# EAGLE design MCU Board V1.2.1 (EAGLE 6.5.0)
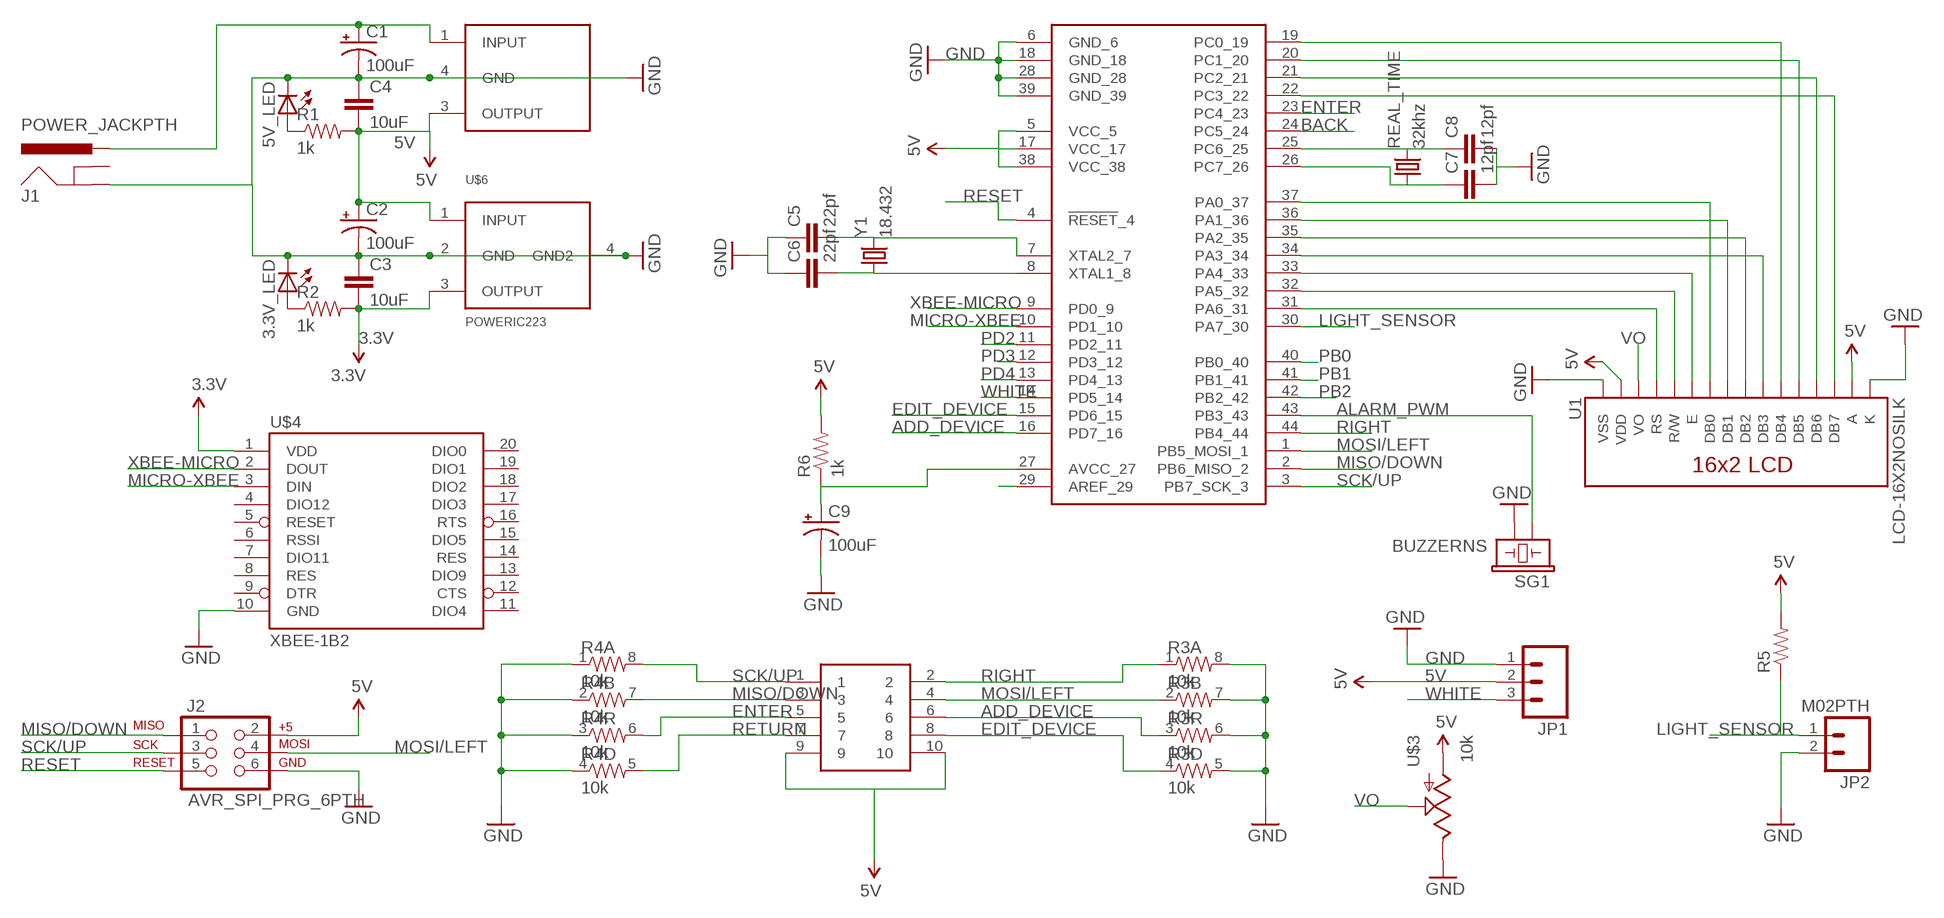
[diagram p0: schematic, sheet 1]

## Parts
3.3V_LED  LED1206  [LED-1206]
5V_LED  LED1206  [LED-1206]
C1  100uF  CAP_POLD  [PANASONIC_D]
C2  100uF  CAP_POLD  [PANASONIC_D]
C3  10uF  CAP1206  [1206]
C4  10uF  CAP1206  [1206]
C5  22pf  CAP0805  [0805]
C6  22pf  CAP0805  [0805]
C7  12pf  CAP0805  [0805]
C8  12pf  CAP0805  [0805]
C9  100uF  CAP_POLD  [PANASONIC_D]
J1  POWER_JACKPTH  [POWER_JACK_PTH]
J2  AVR_SPI_PRG_6PTH  [2X3]
JP1  M03PTH  [1X03]
JP2  M02PTH  [1X02]
R1  1k  RESISTOR1206  [1206]
R2  1k  RESISTOR1206  [1206]
R3  10k  RESISTOR-ARRAY0603-ARV  [0603-ARV]
R4  10k  RESISTOR-ARRAY0603-ARV  [0603-ARV]
R5  RESISTOR1206  [1206]
R6  1k  RESISTOR1206  [1206]
REAL_TIME  32khz  CRYSTALTC26H  [TC26H]
SG1  BUZZERNS  [BUZZER-12MM-NS]
U1  LCD-16X2NOSILK  [LCD-16X2_NOSILK]
U$1  ATMEGA1284  [TQFP44]
U$2  10PIN_HEADER_MALETHROUGH-HOLE  [2X5-SHROUDED]
U$3  10k  POTTRIM  [TRIM_POT]
U$4  XBEE-1B2  [XBEE-SILK]
U$5  DPACK_V_REG  [DPAK]
U$6  POWERIC223  [SOT223]
Y1  18.432  CRYSTALHC49US  [HC49US]

## Nets
3.3V: C3.2 R2.2 U$4.1(VDD) U$6.3(OUTPUT)
5V: C2.+ C4.2 J2.2 JP1.2 R1.2 R5.2 R6.2 U1.2(VDD) U1.15(A) U$1.5(VCC_5) U$1.17(VCC_17) U$1.38(VCC_38) U$2.9 U$2.10 U$3.3(A) U$5.3(OUTPUT) U$6.1(INPUT)
ADD_DEVICE: R3.3 U$1.16(PD7_16) U$2.6
ALARM_PWM: SG1.+ U$1.43(PB3_43)
AREF: U$1.29(AREF_29)
BACK: U$1.24(PC5_24)
EDIT_DEVICE: R3.4 U$1.15(PD6_15) U$2.8
ENTER: R4.6 U$1.23(PC4_23) U$2.5
GND: 3.3V_LED.C 5V_LED.C C1.- C2.- C3.1 C4.1 C5.1 C6.1 C7.2 C8.2 C9.- J1.GND J2.6 JP1.1 JP2.2 R3.5 R3.6 R3.7 R3.8 R4.1 R4.2 R4.3 R4.4 SG1.- U1.1(VSS) U1.16(K) U$1.6(GND_6) U$1.18(GND_18) U$1.28(GND_28) U$1.39(GND_39) U$3.2(E) U$4.10(GND) U$5.4(GND) U$6.2(GND) U$6.4(GND2)
LIGHT_SENSOR: JP2.1 R5.1 U$1.30(PA7_30)
MICRO-XBEE: U$1.10(PD1_10) U$4.3(DIN)
MISO/DOWN: J2.1 R4.7 U$1.2(PB6_MISO_2) U$2.3
MOSI/LEFT: J2.4 R3.2 U$1.1(PB5_MOSI_1) U$2.4
N$1: C7.1 REAL_TIME.1 U$1.26(PC7_26)
N$2: C5.2 U$1.7(XTAL2_7) Y1.2
N$3: C6.2 U$1.8(XTAL1_8) Y1.1
N$4: C8.1 REAL_TIME.2 U$1.25(PC6_25)
N$5: 5V_LED.A R1.1
N$6: 3.3V_LED.A R2.1
N$7: U1.7(DB0) U$1.37(PA0_37)
N$8: U1.8(DB1) U$1.36(PA1_36)
N$9: U1.9(DB2) U$1.35(PA2_35)
N$10: U1.10(DB3) U$1.34(PA3_34)
N$11: U1.6(E) U$1.33(PA4_33)
N$12: U1.5(R/W) U$1.32(PA5_32)
N$13: U1.4(RS) U$1.31(PA6_31)
N$14: U1.11(DB4) U$1.19(PC0_19)
N$15: U1.12(DB5) U$1.20(PC1_20)
N$16: U1.13(DB6) U$1.21(PC2_21)
N$17: U1.14(DB7) U$1.22(PC3_22)
N$19: C9.+ R6.1 U$1.27(AVCC_27)
PB0: U$1.40(PB0_40)
PB1: U$1.41(PB1_41)
PB2: U$1.42(PB2_42)
PD2: U$1.11(PD2_11)
PD3: U$1.12(PD3_12)
PD4: U$1.13(PD4_13)
PWR: C1.+ J1.PWR U$5.1(INPUT)
RESET: J2.5 U$1.4(!RESET!_4)
RETURN: R4.5 U$2.7
RIGHT: R3.1 U$1.44(PB4_44) U$2.2
SCK/UP: J2.3 R4.8 U$1.3(PB7_SCK_3) U$2.1
VO: U1.3(VO) U$3.1(S)
WHITE: JP1.3 U$1.14(PD5_14)
XBEE-MICRO: U$1.9(PD0_9) U$4.2(DOUT)
Unconnected: J1.GNDBREAK U$4.4(DIO12) U$4.5(RESET) U$4.6(RSSI) U$4.7(DIO11) U$4.8(RES) U$4.9(DTR) U$4.11(DIO4) U$4.12(CTS) U$4.13(DIO9) U$4.14(RES) U$4.15(DIO5) U$4.16(RTS) U$4.17(DIO3) U$4.18(DIO2) U$4.19(DIO1) U$4.20(DIO0)

## Library data of the parts
3.3V_LED 5V_LED = SparkFun-LED:LED: LEDs Standard schematic elements and footprints for 5mm, 3mm, 1206, and 0603 sized LEDs. 5mm - Spark Fun Electronics SKU : COM-00529 (and others)
C1 C2 C9 = SparkFun-Capacitors:CAP_POL: Capacitor Polarized These are standard SMD and PTH capacitors. Normally 10uF, 47uF, and 100uF in electrolytic and tantalum varieties. Always verify the external diameter of the through hole cap, it varies with capacity, voltage, and manufacturer. The EIA devices should be standard.
C3-C6 = SparkFun-Capacitors:CAP: Capacitor Standard 0603 ceramic capacitor, and 0.1" leaded capacitor.
C7 C8 = SparkFun-Passives:CAP: Capacitor Standard 0603 ceramic capacitor, and 0.1" leaded capacitor.
J1 = SparkFun-Connectors:POWER_JACK: Power Jack This is the standard 5.5mm barrel jack for power. The PTH is the most common, proven, reliable, footprint. The Slot footprint only works if the mill layer is transmitted to the PCB fab house so be warned. Spark Fun Electronics SKU : PRT-00119 SMT: CONN-08106 Mating wall wart : TOL-00298 (and others)
J2 = SparkFun-Connectors:AVR_SPI_PRG_6: AVR ISP 6 Pin This is the reduced ISP connector for AVR programming. Common on Arduino. This footprint will take up less PCB space and can be used with a 10-pin to 6-pin adapter such as SKU: BOB-08508
JP1 = SparkFun-Connectors:M03: Header 3 Standard 3-pin 0.1" header. Use with straight break away headers (SKU : PRT-00116), right angle break away headers (PRT-00553), swiss pins (PRT-00743), machine pins (PRT-00117), and female headers (PRT-00115). Molex polarized connector foot print use with SKU : PRT-08232 with associated crimp pins and housings.
JP2 = SparkFun-Connectors:M02: Standard 2-pin 0.1" header. Use with - straight break away headers ( PRT-00116) - right angle break away headers (PRT-00553) - swiss pins (PRT-00743) - machine pins (PRT-00117) - female headers (PRT-00115) Molex polarized connector foot print use with: PRT-08233 with associated crimp pins and housings. 2.54_SCREWTERM for use with PRT-10571. 3.5mm Screw Terminal footprints for PRT-08084 5mm Screw Terminal footprints for use with PRT-08433
R1 R2 R5 R6 = SparkFun-Resistors:RESISTOR: Resistor Basic schematic elements and footprints for 0603, 1206, and PTH resistors.
R3 R4 = SparkFun-Resistors:RESISTOR-ARRAY: Array Chip Resistor Source: RS Component / Phycomp
REAL_TIME Y1 = SparkFun-FreqCtrl:CRYSTAL: Various standard crystals. Proven footprints. Spark Fun Electronics SKU : COM-00534
SG1 = SparkFun-Electromechanical:BUZZER: Buzzer 12mm Spark Fun Electronics SKU : Comp-Buzzer
U1 = SparkFun-Displays:LCD-16X2: Standard text-only 16x2 parallel input LCD
U$1 = NU STEM:ATMEGA1284
U$2 = NU STEM:10PIN_HEADER_MALE
U$3 = SparkFun-Electromechanical:POT
U$4 = SparkFun-RF:XBEE-1: Xbee module footprints SMT header is CONN-09042.
U$5 = NU STEM:DPACK_V_REG
U$6 = NU STEM:POWERIC223

## Board
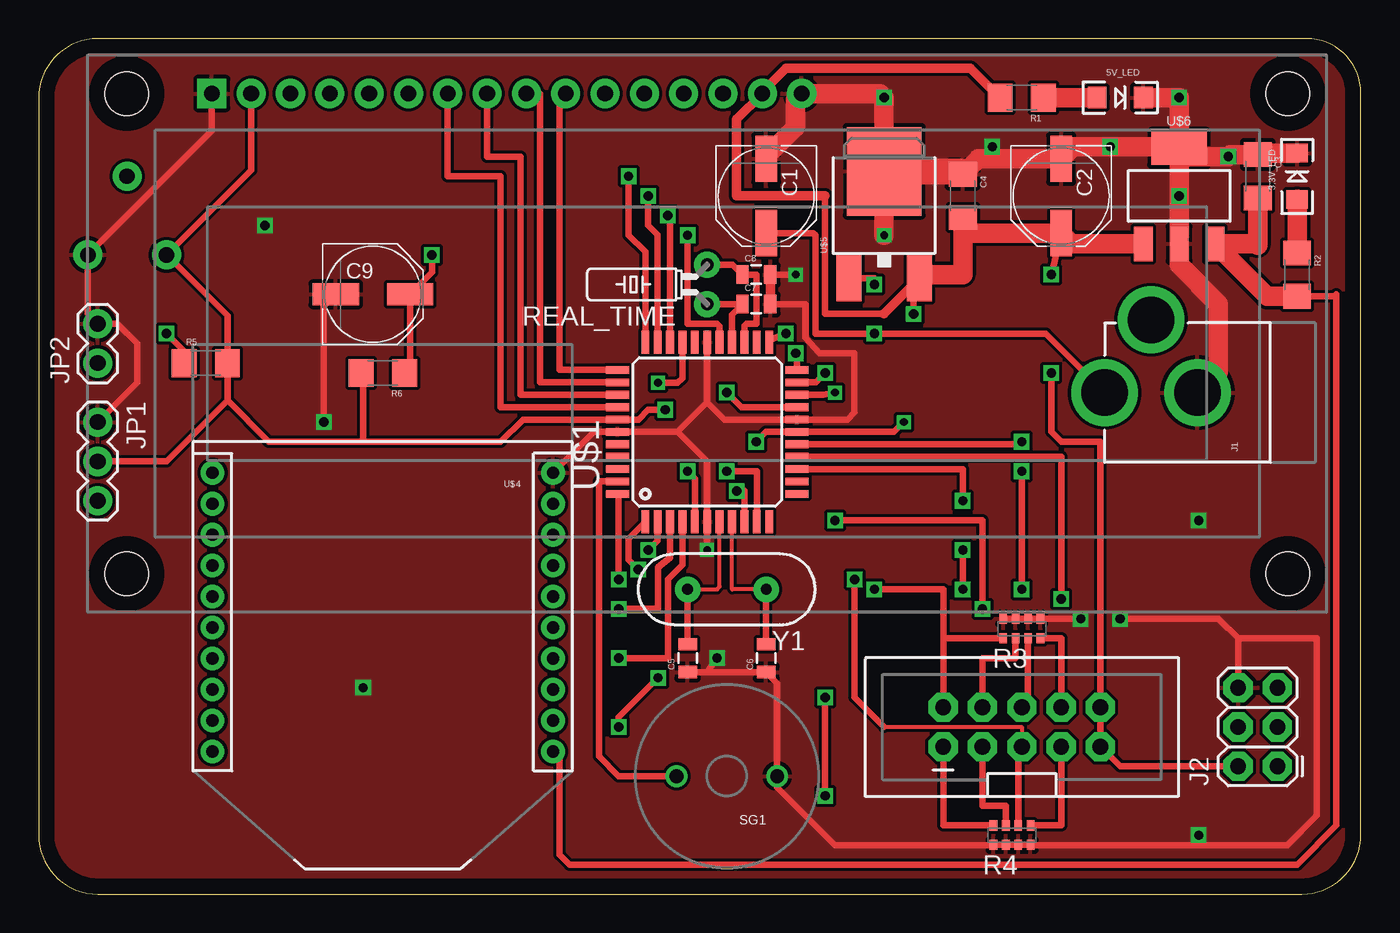
[diagram p1: board, top side]
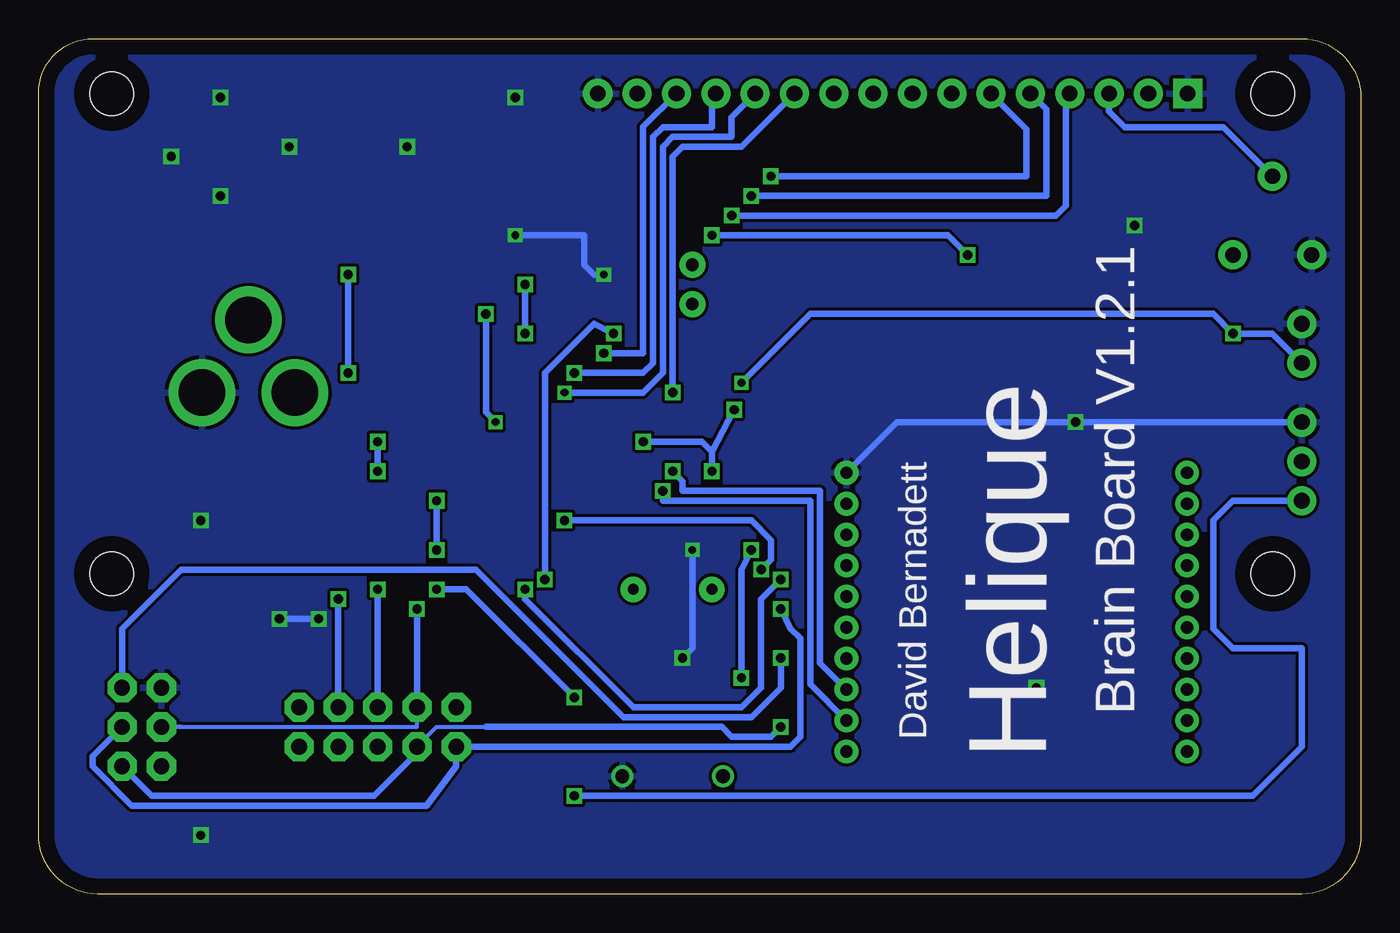
[diagram p2: board, bottom side, seen from below]

Size 85.39 x 55.23 mm. Coordinates in mm from the lower left corner, seen from the top.
Outline: 0,51.42 0,3.81 arc90 3.81,0 81.57,0 arc90 85.39,3.82 85.39,51.76 arc90 81.92,55.23 3.81,55.23 arc90 0,51.42
Copper layers (1*16): Top 0.035mm / dielectric 1.5mm / Bottom 0.035mm
Design rules "default *": minimum track width 10mil, minimum drill 13mil, track to track 8mil, track to pad 8mil, pad to pad 8mil, via to via 8mil, smd to smd 8mil, copper to edge 40mil, drill to drill 8mil, minimum pad ring 10mil, minimum via ring 8mil, stop-mask expansion 4mil, vias tented up to drill 0mil, thermal gap 10mil

### Footprints (pad centres in the part's own frame; a part is rotated, then mirrored left to right if it is on the bottom)
LED-1206 = smd 1.2 x 1.4: A -1.5,0; C 1.5,0
PANASONIC_D = smd 3 x 1.4: + 2.4,0; - -2.4,0
1206 = smd 1.6 x 1.8: 1 -1.4,0; 2 1.4,0
0805 = smd 0.8 x 1.2: 1 -0.9,0; 2 0.9,0
POWER_JACK_PTH = drill 2.997 pad 4.318: GND 0,7.7; GNDBREAK 4.7,10.7; PWR 0,13.7
2X3 = drill 1.016 pad 1.88 octagon: 1 0,0; 2 0,2.54; 3 2.54,0; 4 2.54,2.54; 5 5.08,0; 6 5.08,2.54
1X03 = drill 1.016 pad 1.88: 1 0,0; 2 2.54,0; 3 5.08,0
1X02 = drill 1.016 pad 1.88: 1 0,0; 2 2.54,0
0603-ARV = smd 0.5 x 0.65: 1 -1.2,-0.625; 2 -0.4,-0.625; 3 0.4,-0.625; 4 1.2,-0.625; 5 1.2,0.625; 6 0.4,0.625; 7 -0.4,0.625; 8 -1.2,0.625
TC26H = drill 0.813 pad 1.676: 1 -1.27,0; 2 1.27,0
BUZZER-12MM-NS = drill 0.9: + 3.25,0; - -3.25,0
LCD-16X2_NOSILK = drill 1.016 pad 1.88 square: 1 -32,15.5 | drill 1.016 pad 1.88: 2 -29.46,15.5; 3 -26.92,15.5; 4 -24.38,15.5; 5 -21.84,15.5; 6 -19.3,15.5; 7 -16.76,15.5; 8 -14.22,15.5; 9 -11.68,15.5; 10 -9.14,15.5; 11 -6.6,15.5; 12 -4.06,15.5; 13 -1.52,15.5; 14 1.02,15.5; 15 3.56,15.5; 16 6.1,15.5 | hole 2.8: -37.5,15.5; -37.5,-15.5; 37.5,15.5; 37.5,-15.5
TQFP44 = smd 1.5 x 0.5: 1 -5.8,4; 2 -5.8,3.2; 3 -5.8,2.4; 4 -5.8,1.6; 5 -5.8,0.8; 6 -5.8,0; 7 -5.8,-0.8; 8 -5.8,-1.6; 9 -5.8,-2.4; 10 -5.8,-3.2; 11 -5.8,-4; 23 5.8,-4; 24 5.8,-3.2; 25 5.8,-2.4; 26 5.8,-1.6; 27 5.8,-0.8; 28 5.8,0; 29 5.8,0.8; 30 5.8,1.6; 31 5.8,2.4; 32 5.8,3.2; 33 5.8,4 | smd 0.5 x 1.5: 12 -4,-5.8; 13 -3.2,-5.8; 14 -2.4,-5.8; 15 -1.6,-5.8; 16 -0.8,-5.8; 17 0,-5.8; 18 0.8,-5.8; 19 1.6,-5.8; 20 2.4,-5.8; 21 3.2,-5.8; 22 4,-5.8; 34 4,5.8; 35 3.2,5.8; 36 2.4,5.8; 37 1.6,5.8; 38 0.8,5.8; 39 0,5.8; 40 -0.8,5.8; 41 -1.6,5.8; 42 -2.4,5.8; 43 -3.2,5.8; 44 -4,5.8
2X5-SHROUDED = drill 1.016 pad 1.88 octagon: 1 -1.27,5.08; 2 1.27,5.08; 3 -1.27,2.54; 4 1.27,2.54; 5 -1.27,0; 6 1.27,0; 7 -1.27,-2.54; 8 1.27,-2.54; 9 -1.27,-5.08; 10 1.27,-5.08
TRIM_POT = drill 1 pad 1.88: 1 5.08,0; 2 0,2.54; 3 0,-2.54
XBEE-SILK = drill 0.8 pad 1.524: 1 -11,20; 2 -11,18; 3 -11,16; 4 -11,14; 5 -11,12; 6 -11,10; 7 -11,8; 8 -11,6; 9 -11,4; 10 -11,2; 11 11,2; 12 11,4; 13 11,6; 14 11,8; 15 11,10; 16 11,12; 17 11,14; 18 11,16; 19 11,18; 20 11,20
DPAK = smd 1.6 x 3: 1 -2.28,-5.31; 3 2.28,-5.31 | smd 4.826 x 5.715: 4 0,1.588
SOT223 = smd 1.219 x 2.235: 1 -2.311,-3.099; 2 0,-3.099; 3 2.311,-3.099 | smd 3.6 x 2.2: 4 0,3.099
HC49US = drill 0.7 pad 1.651: 1 -2.54,0; 2 2.54,0

### Placement (x,y rotation side)
3.3V_LED  81.28,46.35 90 top
5V_LED  69.85,51.44 0 top
C1  46.99,45.09 270 top
C2  66.04,45.09 270 top
C3  78.74,46.35 270 top
C4  59.69,45.09 270 top
C5  41.91,15.24 90 top
C6  46.99,15.24 90 top
C7  46.35,38.1 0 top
C8  46.35,40.01 0 top
C9  21.59,38.73 0 top
J1  82.55,32.38 90 top
J2  80.01,8.26 90 top
JP1  3.81,30.48 270 top
JP2  3.81,34.29 90 top
R1  63.5,51.44 180 top
R2  81.28,40.01 270 top
R3  63.5,17.14 0 top
R4  62.87,3.81 0 top
R5  10.79,34.29 0 top
R6  22.23,33.66 180 top
REAL_TIME  43.18,39.37 90 top
SG1  44.45,7.62 180 top
U1  43.18,36.2 0 top
U$1  43.18,29.84 90 top
U$2  63.5,10.79 90 top
U$3  5.71,41.27 90 top
U$4  22.23,29.21 180 top
U$5  54.61,45.09 0 top
U$6  73.66,45.09 0 top
Y1  44.45,19.68 180 top

### Tracks (layer width: path | path; a pad name or v marks a point on that pad's centre or on a via)
3.3V
  Top 0.406: U$4.1 33.66,8.78 33.66,2.54 34.29,1.91 81.28,1.91 83.82,4.45 83.82,38.73 83.69,38.6 R2.2
  Top 1.27: C3.2 78.74,41.91 78.66,41.99 U$6.3 79.35,38.6 R2.2
5V  (via drill 0.5, 0.6)
  Top 0.406: 54.61,37.47 50.8,37.47 50.8,45.09 | J2.2 69.85,8.26 U$2.9 U$2.10 68.58,29.21 66.04,29.21 65.41,29.84 v65.41,33.66 | v65.41,40.01 C2.+ | U1.2 13.72,46.74 U$3.3 12.2,37.34 R5.2 12.2,31.88 | JP1.2 8.26,27.94 12.2,31.88 | v40.48,31.28 39.37,31.28 38.73,30.64 U$1.38 31.28,30.64 29.84,29.21 20.95,29.21 | v41.91,27.3 42.38,26.84 U$1.5 | v46.35,29.21 46.99,29.84 U$1.17 55.24,29.84 v55.88,30.48 | v56.52,37.47 56.52,39.37 | 12.2,31.88 14.87,29.21 20.95,29.21 | R6.2 20.95,33.52 20.95,29.21
  Top 0.61: R1.2 60.2,53.34 48.26,53.34 46.74,51.82 U1.15 45.09,50.04 45.09,45.09 50.8,45.09 | U$5.3 56.89,39.74 56.52,39.37 54.61,37.47
  Top 1.27: C4.2 59.69,43.18 | 59.69,43.18 59.69,40.01 56.89,40.01 U$5.3 | U$6.1 66.74,41.99 C2.+ 60.19,42.69 59.69,43.18
  Bottom 0.406: v65.41,33.66 v65.41,40.01 | v40.48,31.28 41.91,28.57 | 41.91,28.57 v41.91,27.3 | 41.91,28.57 42.55,29.21 v46.35,29.21 | v55.88,30.48 56.52,31.11 v56.52,37.47
ADD_DEVICE  (via drill 0.6)
  Top 0.406: U$2.6 63.9,12.46 R3.3 | U$1.16 63.5,29.05 v63.5,29.21 | v63.5,27.3 v63.5,19.68
  Bottom 0.406: v63.5,29.21 v63.5,27.3 | v63.5,19.68 U$2.6
ALARM_PWM
  Top 0.406: U$1.43 37.35,26.67 36.2,26.67 36.2,8.89 37.47,7.62 SG1.+
EDIT_DEVICE  (via drill 0.6)
  Top 0.406: 64.77,16.59 R3.4 66.04,16.52 U$2.8 | U$1.15 66.04,28.25 v66.04,19.05
  Bottom 0.406: v66.04,19.05 U$2.8
ENTER  (via drill 0.6)
  Top 0.254: 54.61,10.79 63.5,10.79 U$2.5
  Top 0.406: U$2.5 63.27,9.29 R4.6 | U$1.23 47.18,35.75 v48.26,36.2 | v52.7,20.32 52.7,12.7 54.61,10.79
  Bottom 0.406: v48.26,36.2 49.53,36.83 52.7,33.66 v52.7,20.32
GND  (via drill 0.5, 0.6)
  Top 0.406: C8.2 v48.9,40.01 | R3.8 R3.7 R3.6 R3.5 v67.31,17.78 | v69.85,17.78 76.2,17.78 77.47,16.51 | 77.47,16.51 J2.6 | C5.1 43.18,14.34 | 43.18,14.34 C6.1 47.7,13.63 SG1.- 47.7,6.91 51.44,3.17 61.66,3.17 R4.1 R4.2 R4.3 R4.4 64.08,3.17 80.64,3.17 82.55,5.08 82.55,16.51 77.47,16.51 | v43.18,22.23 U$1.6 43.18,27.94 41.27,29.84 | v43.81,15.24 43.18,14.34 | 41.27,29.84 U$1.39 35.86,29.84 U$4.10 | U$1.28 43.18,31.75 | 43.18,31.75 41.27,29.84 | 43.18,31.75 44.28,30.64 U$1.18 52.23,30.64 52.7,31.11 52.7,34.92 50.43,34.92 49.53,35.94 49.53,38.1 C7.2 | JP1.1 6.35,33.02 6.35,35.56 5.08,36.83 JP2.2 3.17,37.47 U$3.2 11.18,49.28 U1.1 | C9.- 18.41,37.96 v18.41,30.48
  Top 0.61: C7.2 C8.2
  Top 1.27: 66.74,48.18 C2.- 60.69,47.48 C4.1 59.5,46.67 | U$6.4 74.22,47.62 v76.83,47.62 76.97,47.76 C3.1 78.84,47.85 3.3V_LED.C | U$6.2 73.66,40.64 76.2,38.1 76.2,33.73 J1.GND | C1.- 46.99,47.62 48.9,49.53 48.9,51.31 U1.16 54.35,51.7 v54.61,51.44 U$5.4 v54.61,42.55 | U$6.4 v73.66,51.44 5V_LED.C | U$6.4 73.58,48.26 v69.22,48.26 66.67,48.26 | U$6.4 v73.66,45.09 73.66,42.55
  Top 1.676: U$5.4 59.5,46.67
  Bottom 0.406: v48.9,40.01 49.53,40.01 50.16,40.64 50.16,42.55 v54.61,42.55 | v67.31,17.78 v69.85,17.78 | v43.18,22.23 43.18,15.88 v43.81,15.24 | U$4.10 29.95,30.48 v18.41,30.48 JP1.1
  other vias: 20.95,13.34 14.61,43.18 74.93,3.81 74.93,24.13 61.59,48.26
  pour Bottom: -0.64,55.88 -0.64,0 86.36,0 85.72,55.88
  pour Top: 0,55.24 85.72,55.24 85.72,0 0,0
LIGHT_SENSOR  (via drill 0.5, 0.6)
  Top 0.406: v8.26,36.2 9.39,35.05 R5.1 | v40.01,33.02 41.27,33.02 41.58,33.33 U$1.30
  Bottom 0.406: JP2.1 5.71,36.2 v8.26,36.2 9.53,37.47 35.56,37.47 v40.01,33.02
MICRO-XBEE  (via drill 0.6)
  Top 0.406: U$1.10 46.38,27.3 v44.45,27.3
  Bottom 0.406: U$4.3 34.92,14.91 34.92,26.04 43.81,26.04 43.81,26.67 v44.45,27.3
MISO/DOWN  (via drill 0.6)
  Top 0.406: U$2.3 60.96,5.71 62.47,5.71 R4.7 | v37.47,10.79 37.47,11.43 v40.01,13.97 | v39.37,22.23 39.98,22.84 U$1.2
  Bottom 0.254: U$2.3 59.69,10.79 56.52,10.79
  Bottom 0.406: J2.1 78.11,6.35 63.73,6.35 60.96,9.12 U$2.3 | 56.52,10.79 41.27,10.79 40.64,10.16 38.1,10.16 v37.47,10.79 | v40.01,13.97 40.01,20.95 v39.37,22.23
MOSI/LEFT  (via drill 0.6)
  Top 0.406: U$2.4 60.96,15.24 63.1,15.24 R3.2 | U$1.1 38.1,22.96 38.1,21.59 v38.73,20.95 | v51.44,24.13 60.96,24.13 v60.96,18.41
  Bottom 0.254: 76.2,10.79 60.96,10.79 U$2.4
  Bottom 0.305: J2.4 76.2,10.79
  Bottom 0.406: v38.73,20.95 38.1,21.59 38.1,22.86 39.37,24.13 v51.44,24.13 | v60.96,18.41 U$2.4
N$1
  Top 0.406: REAL_TIME.1 C7.1 44.78,37.42 U$1.26
N$2
  Top 0.254: Y1.2 43.81,19.68 43.98,19.85 U$1.7
  Top 0.406: Y1.2 C5.2
N$3
  Top 0.254: Y1.1 44.78,19.68 U$1.8
  Top 0.406: C6.2 Y1.1
N$4
  Top 0.406: REAL_TIME.2 44.82,40.64 C8.1 46.35,40.01 46.35,36.83 45.72,36.83 45.58,36.69 U$1.25
N$5
  Top 1.27: R1.1 5V_LED.A
N$6
  Top 1.27: 3.3V_LED.A R2.1
N$7
  Top 0.406: U$1.37 29.84,31.45 29.84,46.35 26.42,46.35 U1.7
N$8
  Top 0.406: U$1.36 31.11,32.24 31.11,47.62 28.96,47.62 U1.8
N$9
  Top 0.406: U$1.35 32.38,33.05 32.38,51.7 U1.9
N$10
  Top 0.406: U$1.34 33.66,33.84 33.66,51.7 U1.10
N$11  (via drill 0.6)
  Top 0.406: v38.1,46.35 38.1,42.55 39.18,41.47 U$1.33
  Bottom 0.406: U1.6 21.59,49.41 21.59,46.35 v38.1,46.35
N$12  (via drill 0.6)
  Top 0.406: v39.37,45.09 39.37,43.18 39.98,42.57 U$1.32
  Bottom 0.406: U1.5 20.32,50.67 20.32,45.09 v39.37,45.09
N$13  (via drill 0.6)
  Top 0.406: v40.64,43.81 40.78,43.67 U$1.31
  Bottom 0.406: U1.4 19.05,51.45 19.05,44.45 19.68,43.81 v40.64,43.81
N$14  (via drill 0.6)
  Top 0.406: v44.45,32.38 45.39,31.45 U$1.19
  Bottom 0.406: U1.11 40.02,48.26 43.81,48.26 44.45,47.62 v44.45,32.38
N$15  (via drill 0.5)
  Top 0.406: v51.44,32.38 50.66,32.24 U$1.20
  Bottom 0.406: U1.12 40.64,50.17 40.64,48.9 44.45,48.9 45.09,48.26 45.09,33.66 46.35,32.38 v51.44,32.38
N$16  (via drill 0.6)
  Top 0.406: v50.8,33.66 50.19,33.05 U$1.21
  Bottom 0.406: U1.13 41.91,51.45 41.91,49.53 45.09,49.53 45.72,48.9 45.72,34.29 46.35,33.66 v50.8,33.66
N$17  (via drill 0.6)
  Top 0.406: v48.9,34.92 48.98,34.84 U$1.22
  Bottom 0.406: U1.14 46.35,49.54 46.35,34.92 v48.9,34.92
N$19  (via drill 0.6)
  Top 0.406: R6.1 23.99,34.02 C9.+ 25.4,40.15 v25.4,41.27 | v41.91,42.55 41.91,36.83 43.81,36.83 43.98,36.66 U$1.27
  Bottom 0.406: v25.4,41.27 26.67,42.55 v41.91,42.55
PWR  (via drill 0.6)
  Top 0.406: U$5.1 53.98,39.77 v53.98,39.37 | J1.PWR 65.04,36.2 v53.98,36.2 50.16,36.2 50.16,42.55 50.02,42.69 C1.+
  Bottom 0.406: v53.98,39.37 v53.98,36.2
RESET  (via drill 0.6)
  Top 0.406: v37.47,15.24 40.64,15.24 40.64,20.32 41.58,21.26 U$1.4
  Bottom 0.406: J2.5 80.01,17.14 76.2,20.95 57.15,20.95 47.62,11.43 39.37,11.43 37.47,13.34 v37.47,15.24
RETURN
  Top 0.406: R4.5 66.04,4.43 U$2.7
RIGHT  (via drill 0.6)
  Top 0.406: R3.1 58.42,16.52 | 58.42,16.52 U$2.2 | U$1.44 37.47,25.76 v37.47,20.32 | v53.98,19.68 58.42,19.68 58.42,16.52
  Bottom 0.406: v37.47,20.32 38.73,19.05 38.73,13.34 40.01,12.06 46.99,12.06 53.98,19.05 v53.98,19.68
SCK/UP  (via drill 0.6)
  Top 0.406: R4.8 58.42,4.43 U$2.1 | v37.47,18.41 40.01,18.41 40.01,21.09 40.78,21.73 U$1.3
  Bottom 0.406: J2.3 81.92,8.89 81.92,8.26 79.38,5.71 60.33,5.71 58.42,8.26 U$2.1 36.83,9.53 36.2,10.16 36.2,16.51 36.83,17.14 v37.47,18.41
VO
  Bottom 0.406: U$3.1 8.89,49.53 15.24,49.53 16.26,50.55 U1.3
WHITE  (via drill 0.6)
  Top 0.406: U$1.14 59.69,27.45 v59.69,25.4 | v59.69,22.23 v59.69,19.68 | v50.8,12.7 v50.8,6.35
  Bottom 0.406: v59.69,25.4 v59.69,22.23 | v59.69,19.68 57.78,19.68 v50.8,12.7 | v50.8,6.35 6.99,6.35 3.81,9.53 3.81,15.88 8.26,15.88 9.53,17.14 9.53,24.13 8.26,25.4 JP1.3
XBEE-MICRO  (via drill 0.6)
  Top 0.406: U$1.9 45.58,26.04 v45.09,26.04
  Bottom 0.406: v45.09,26.04 45.09,25.4 35.56,25.4 35.56,13.54 U$4.2

### Text on the board
bPlace: Brain Board V1.2.1 | Helique | David Bernadett